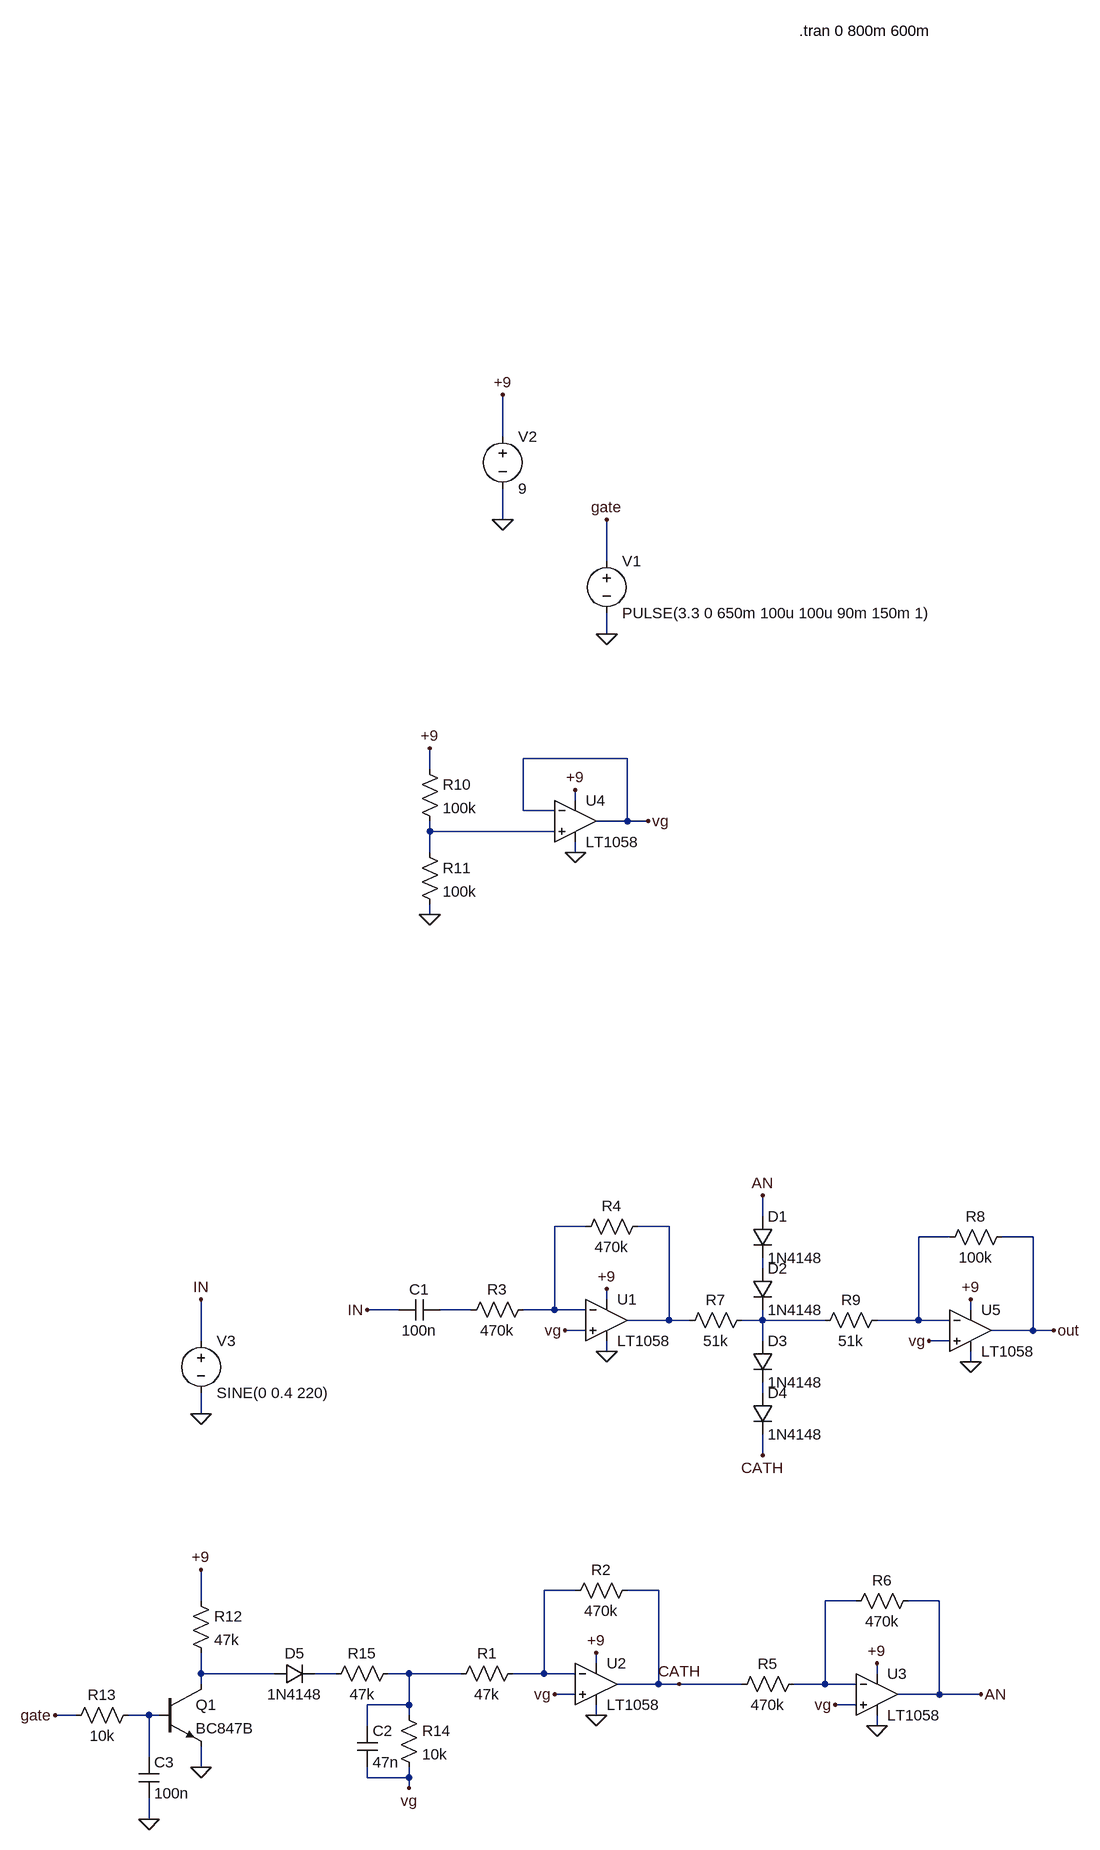
[diagram p0: schematic AttenuatorSim.asc]
AttenuatorSim.asc, the LTspice schematic file:
Version 4
SHEET 1 3420 3584
WIRE -496 736 -496 672
WIRE -496 864 -496 816
WIRE -336 928 -336 864
WIRE -336 1040 -336 1008
WIRE -304 1232 -464 1232
WIRE -608 1248 -608 1216
WIRE -384 1296 -384 1280
WIRE -464 1312 -464 1232
WIRE -416 1312 -464 1312
WIRE -304 1328 -304 1232
WIRE -304 1328 -352 1328
WIRE -272 1328 -304 1328
WIRE -608 1344 -608 1328
WIRE -416 1344 -608 1344
WIRE -608 1376 -608 1344
WIRE -384 1376 -384 1360
WIRE -608 1472 -608 1456
WIRE -96 1936 -96 1904
WIRE -368 1952 -416 1952
WIRE -240 1952 -288 1952
WIRE 192 1968 144 1968
WIRE 320 1968 272 1968
WIRE -96 2016 -96 2000
WIRE -336 2064 -336 2048
WIRE -656 2080 -704 2080
WIRE -544 2080 -592 2080
WIRE -416 2080 -416 1952
WIRE -416 2080 -464 2080
WIRE -368 2080 -416 2080
WIRE 224 2080 224 2064
WIRE -240 2096 -240 1952
WIRE -240 2096 -304 2096
WIRE -208 2096 -240 2096
WIRE -96 2096 -96 2080
WIRE -96 2096 -128 2096
WIRE 0 2096 -96 2096
WIRE 144 2096 144 1968
WIRE 144 2096 80 2096
WIRE 192 2096 144 2096
WIRE -368 2112 -400 2112
WIRE 320 2112 320 1968
WIRE 320 2112 256 2112
WIRE 352 2112 320 2112
WIRE -960 2128 -960 2064
WIRE -96 2128 -96 2096
WIRE 192 2128 160 2128
WIRE -336 2144 -336 2128
WIRE 224 2160 224 2144
WIRE -96 2208 -96 2192
WIRE -960 2240 -960 2208
WIRE -96 2304 -96 2272
WIRE -384 2512 -432 2512
WIRE -256 2512 -304 2512
WIRE -960 2528 -960 2480
WIRE 48 2528 0 2528
WIRE 176 2528 128 2528
WIRE -352 2624 -352 2608
WIRE -960 2640 -960 2608
WIRE -848 2640 -960 2640
WIRE -752 2640 -784 2640
WIRE -640 2640 -672 2640
WIRE -560 2640 -640 2640
WIRE -432 2640 -432 2512
WIRE -432 2640 -480 2640
WIRE -384 2640 -432 2640
WIRE 80 2640 80 2624
WIRE -960 2656 -960 2640
WIRE -256 2656 -256 2512
WIRE -256 2656 -320 2656
WIRE -224 2656 -256 2656
WIRE -128 2656 -224 2656
WIRE 0 2656 0 2528
WIRE 0 2656 -48 2656
WIRE 48 2656 0 2656
WIRE -384 2672 -416 2672
WIRE 176 2672 176 2528
WIRE 176 2672 112 2672
WIRE 240 2672 176 2672
WIRE -640 2688 -640 2640
WIRE -640 2688 -704 2688
WIRE 48 2688 16 2688
WIRE -1152 2704 -1184 2704
WIRE -1040 2704 -1072 2704
WIRE -1024 2704 -1040 2704
WIRE -640 2704 -640 2688
WIRE -352 2704 -352 2688
WIRE -704 2720 -704 2688
WIRE 80 2720 80 2704
WIRE -1040 2768 -1040 2704
WIRE -960 2784 -960 2752
WIRE -704 2800 -704 2784
WIRE -640 2800 -640 2784
WIRE -640 2800 -704 2800
WIRE -640 2816 -640 2800
WIRE -1040 2864 -1040 2832
FLAG -496 672 +9
FLAG -496 864 0
FLAG -384 1280 +9
FLAG -384 1376 0
FLAG -272 1328 vg
FLAG -608 1472 0
FLAG -608 1216 +9
FLAG -336 1040 0
FLAG -336 864 gate
FLAG -960 2064 IN
FLAG -336 2048 +9
FLAG -336 2144 0
FLAG -400 2112 vg
FLAG -704 2080 IN
FLAG -352 2608 +9
FLAG -352 2704 0
FLAG -416 2672 vg
FLAG 80 2624 +9
FLAG 80 2720 0
FLAG 16 2688 vg
FLAG -960 2240 0
FLAG -224 2656 CATH
FLAG 240 2672 AN
FLAG -96 1904 AN
FLAG -96 2304 CATH
FLAG 224 2064 +9
FLAG 224 2160 0
FLAG 160 2128 vg
FLAG 352 2112 out
FLAG -960 2784 0
FLAG -960 2480 +9
FLAG -1184 2704 gate
FLAG -1040 2864 0
FLAG -640 2816 vg
SYMBOL voltage -496 720 R0
SYMATTR InstName V2
SYMATTR Value 9
SYMBOL OpAmps/LT1058 -384 1264 R0
SYMATTR InstName U4
SYMBOL res -624 1232 R0
SYMATTR InstName R10
SYMATTR Value 100k
SYMBOL res -624 1360 R0
SYMATTR InstName R11
SYMATTR Value 100k
SYMBOL voltage -336 912 R0
SYMATTR InstName V1
SYMATTR Value PULSE(3.3 0 650m 100u 100u 90m 150m 1)
SYMBOL voltage -960 2112 R0
SYMATTR InstName V3
SYMATTR Value SINE(0 0.4 220)
SYMBOL OpAmps/LT1058 -336 2032 R0
SYMATTR InstName U1
SYMBOL cap -592 2064 R90
WINDOW 0 0 32 VBottom 2
WINDOW 3 32 32 VTop 2
SYMATTR InstName C1
SYMATTR Value 100n
SYMBOL res -448 2064 R90
WINDOW 0 0 56 VBottom 2
WINDOW 3 32 56 VTop 2
SYMATTR InstName R3
SYMATTR Value 470k
SYMBOL res -272 1936 R90
WINDOW 0 0 56 VBottom 2
WINDOW 3 32 56 VTop 2
SYMATTR InstName R4
SYMATTR Value 470k
SYMBOL OpAmps/LT1058 -352 2592 R0
SYMATTR InstName U2
SYMBOL res -464 2624 R90
WINDOW 0 0 56 VBottom 2
WINDOW 3 32 56 VTop 2
SYMATTR InstName R1
SYMATTR Value 47k
SYMBOL res -288 2496 R90
WINDOW 0 0 56 VBottom 2
WINDOW 3 32 56 VTop 2
SYMATTR InstName R2
SYMATTR Value 470k
SYMBOL OpAmps/LT1058 80 2608 R0
SYMATTR InstName U3
SYMBOL res -32 2640 R90
WINDOW 0 0 56 VBottom 2
WINDOW 3 32 56 VTop 2
SYMATTR InstName R5
SYMATTR Value 470k
SYMBOL res 144 2512 R90
WINDOW 0 0 56 VBottom 2
WINDOW 3 32 56 VTop 2
SYMATTR InstName R6
SYMATTR Value 470k
SYMBOL res -112 2080 R90
WINDOW 0 0 56 VBottom 2
WINDOW 3 32 56 VTop 2
SYMATTR InstName R7
SYMATTR Value 51k
SYMBOL diode -112 1936 R0
SYMATTR InstName D1
SYMATTR Value 1N4148
SYMBOL diode -112 2016 R0
SYMATTR InstName D2
SYMATTR Value 1N4148
SYMBOL diode -112 2128 R0
SYMATTR InstName D3
SYMATTR Value 1N4148
SYMBOL diode -112 2208 R0
SYMATTR InstName D4
SYMATTR Value 1N4148
SYMBOL OpAmps/LT1058 224 2048 R0
SYMATTR InstName U5
SYMBOL res 288 1952 R90
WINDOW 0 0 56 VBottom 2
WINDOW 3 32 56 VTop 2
SYMATTR InstName R8
SYMATTR Value 100k
SYMBOL res 96 2080 R90
WINDOW 0 0 56 VBottom 2
WINDOW 3 32 56 VTop 2
SYMATTR InstName R9
SYMATTR Value 51k
SYMBOL res -976 2512 R0
SYMATTR InstName R12
SYMATTR Value 47k
SYMBOL npn -1024 2656 R0
SYMATTR InstName Q1
SYMATTR Value BC847B
SYMBOL res -1056 2688 R90
WINDOW 0 0 56 VBottom 2
WINDOW 3 32 56 VTop 2
SYMATTR InstName R13
SYMATTR Value 10k
SYMBOL cap -1056 2768 R0
SYMATTR InstName C3
SYMATTR Value 100n
SYMBOL diode -848 2656 R270
WINDOW 0 32 32 VTop 2
WINDOW 3 0 32 VBottom 2
SYMATTR InstName D5
SYMATTR Value 1N4148
SYMBOL res -656 2688 R0
SYMATTR InstName R14
SYMATTR Value 10k
SYMBOL res -656 2624 R90
WINDOW 0 0 56 VBottom 2
WINDOW 3 32 56 VTop 2
SYMATTR InstName R15
SYMATTR Value 47k
SYMBOL cap -720 2720 R0
SYMATTR InstName C2
SYMATTR Value 47n
TEXT -40 112 Left 2 !.tran 0 800m 600m

The netlist it stands for:
* AttenuatorSim.asc
V2 +9 0 9
XU4 N001 vg +9 0 vg LT1057  ; LT1058, pins In+ In- V+ V- OUT
R10 +9 N001 100k
R11 N001 0 100k
V1 gate 0 PULSE(3.3 0 650m 100u 100u 90m 150m 1)
V3 IN 0 SINE(0 0.4 220)
XU1 vg N002 +9 0 N003 LT1057  ; LT1058, pins In+ In- V+ V- OUT
C1 N006 IN 100n
R3 N002 N006 470k
R4 N003 N002 470k
XU2 vg N009 +9 0 CATH LT1057  ; LT1058, pins In+ In- V+ V- OUT
R1 N009 N013 47k
R2 CATH N009 470k
XU3 vg N010 +9 0 AN LT1057  ; LT1058, pins In+ In- V+ V- OUT
R5 N010 CATH 470k
R6 AN N010 470k
R7 N007 N003 51k
D1 AN N005 1N4148
D2 N005 N007 1N4148
D3 N007 N008 1N4148
D4 N008 CATH 1N4148
XU5 vg N004 +9 0 out LT1057  ; LT1058, pins In+ In- V+ V- OUT
R8 out N004 100k
R9 N004 N007 51k
R12 +9 N011 47k
Q1 N011 N014 0 0 BC847B
R13 N014 gate 10k
C3 N014 0 100n
D5 N011 N012 1N4148
R14 N013 vg 10k
R15 N013 N012 47k
C2 N013 vg 47n
.model D D
.lib standard.dio
.model NPN NPN
.model PNP PNP
.lib standard.bjt
.tran 0 800m 600m
.lib LTC.lib
.backanno
.end